# Altium project POETIC_Processor_V2.PrjPcb (part 2 of 2)

## Sheet AD_1.SchDoc
size A2; Date: Date; CompanyName: HESSO; Engineer: Name; Address1: Route du Rawyl 47; Address2: 1950 Sion; Address3: Switzerland; DocumentNumber: 6; SheetNumber: 6; SheetTotal: 8; ProjectName: Project Name
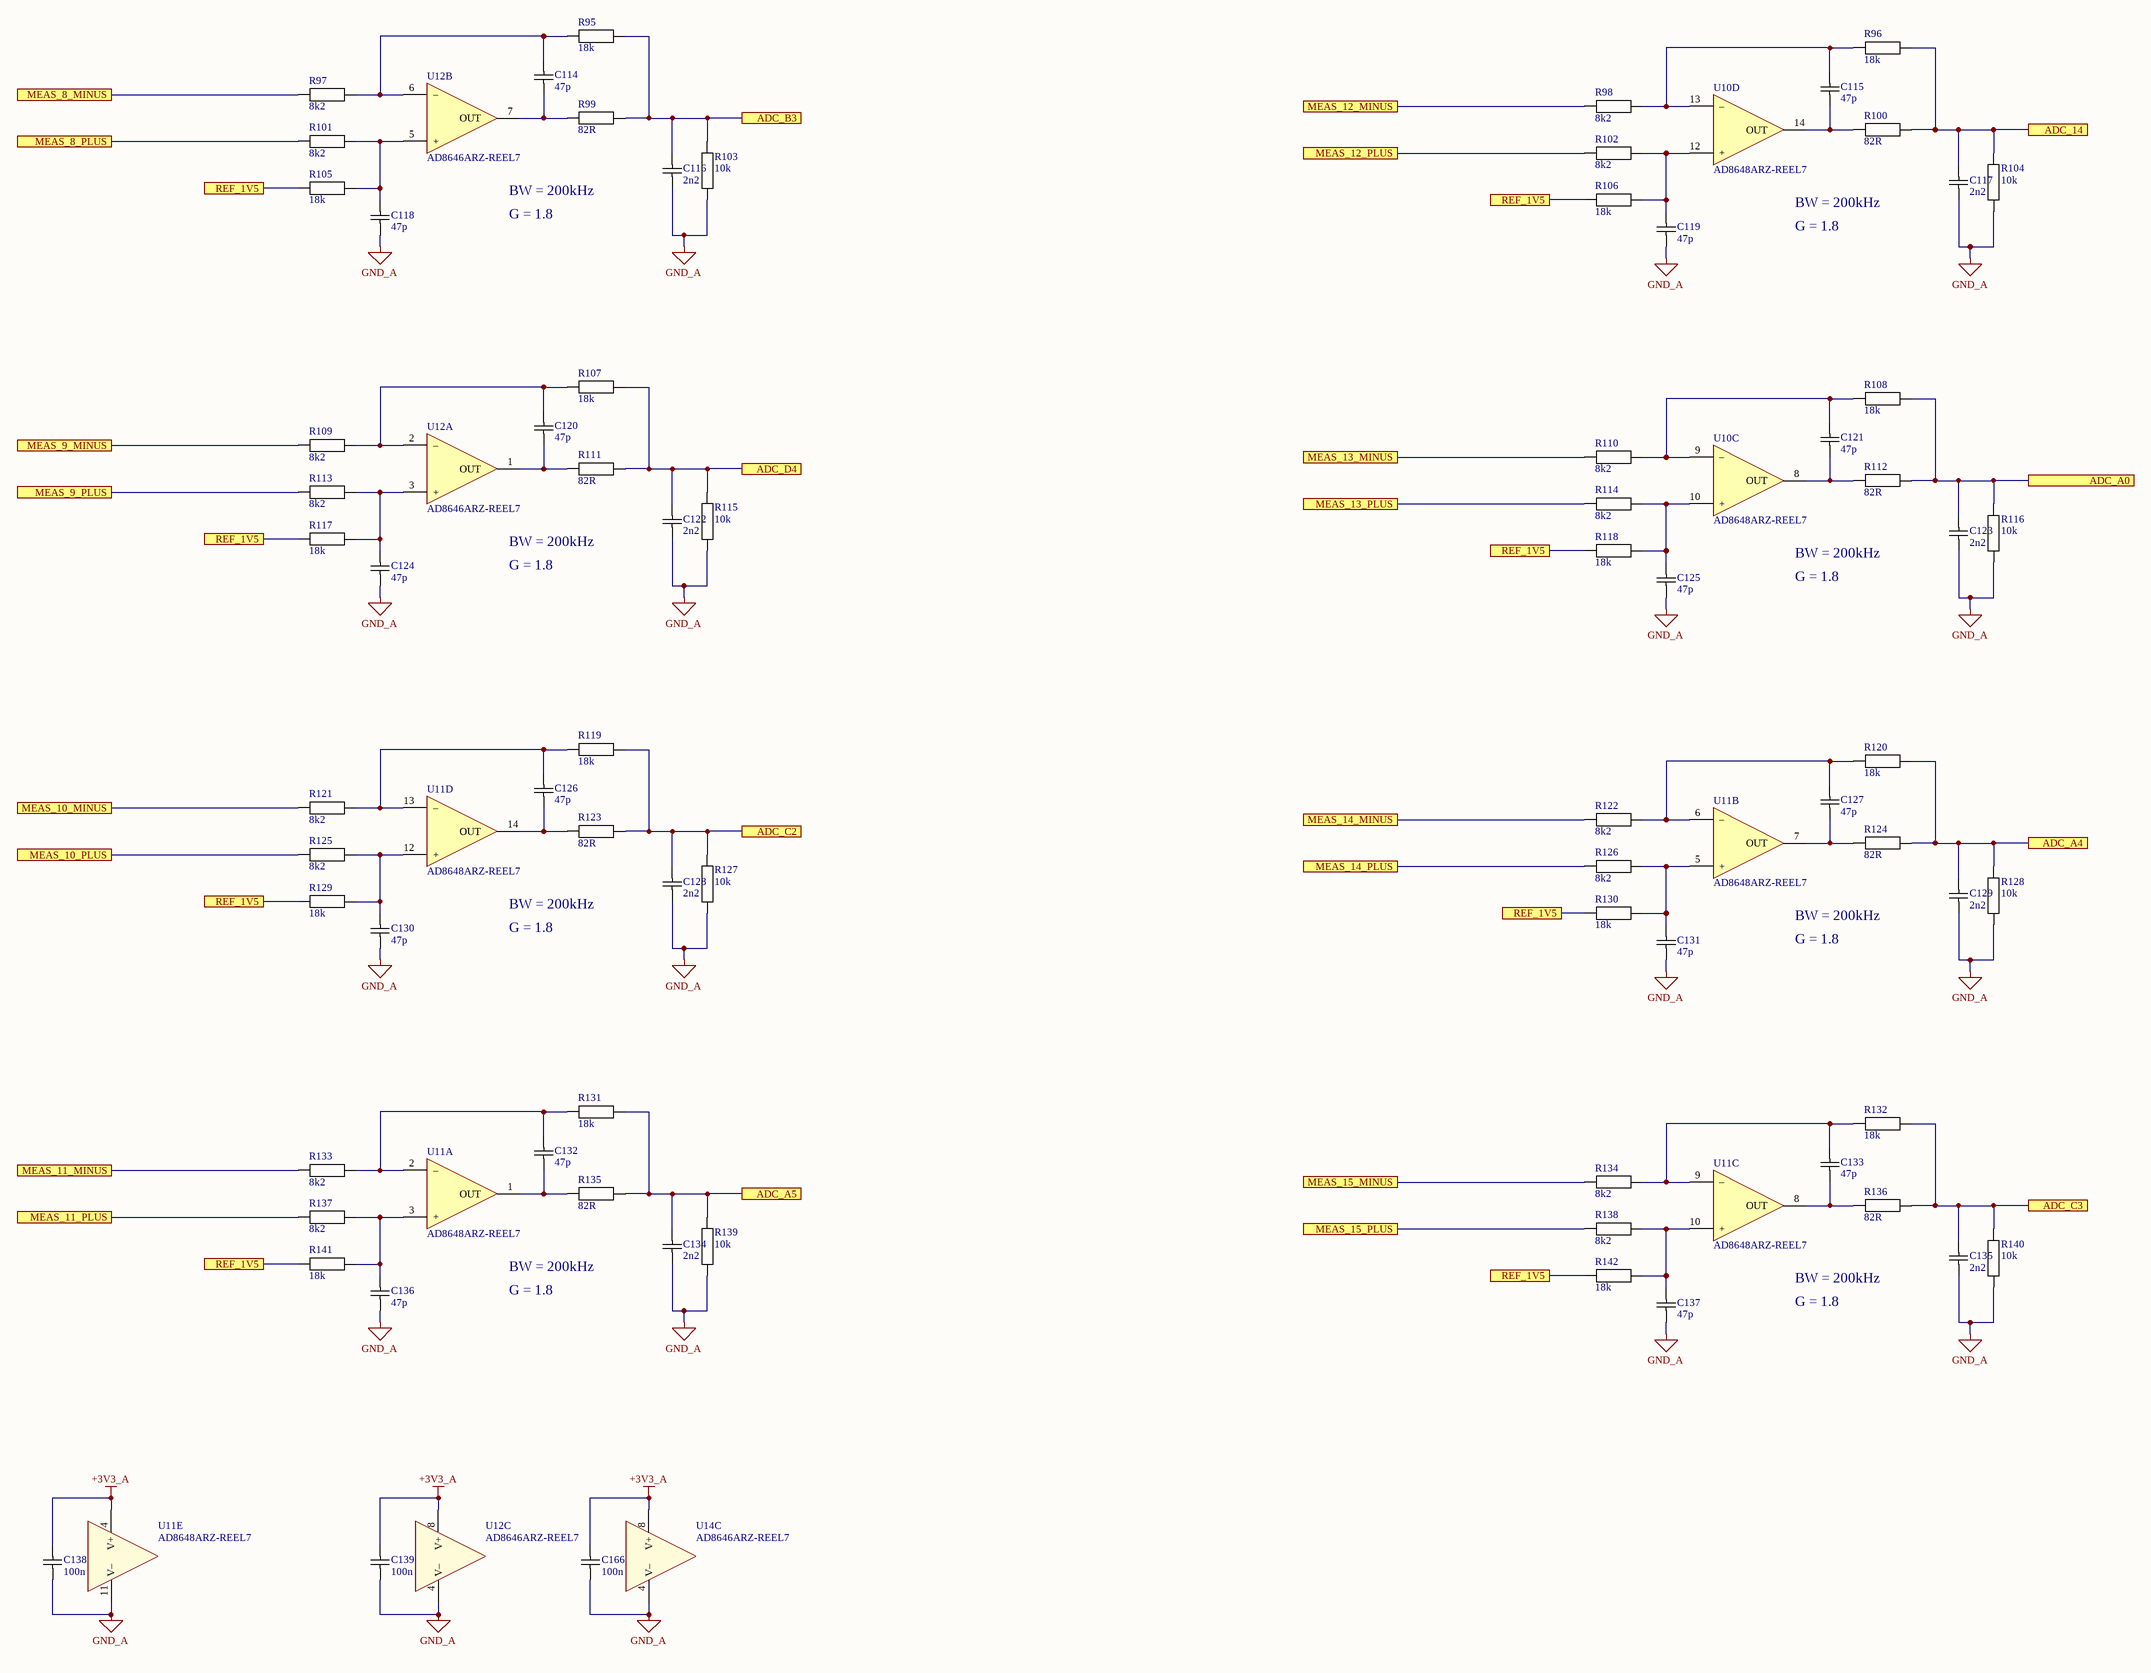
[diagram p9: AD_1.SchDoc]

### Parts
C114  47p  [CAPACITOR 1608 REFLOW]
C115  47p  [CAPACITOR 1608 REFLOW]
C116  2n2  [CAPACITOR 1608 REFLOW]
C117  2n2  [CAPACITOR 1608 REFLOW]
C118  47p  [CAPACITOR 1608 REFLOW]
C119  47p  [CAPACITOR 1608 REFLOW]
C120  47p  [CAPACITOR 1608 REFLOW]
C121  47p  [CAPACITOR 1608 REFLOW]
C122  2n2  [CAPACITOR 1608 REFLOW]
C123  2n2  [CAPACITOR 1608 REFLOW]
C124  47p  [CAPACITOR 1608 REFLOW]
C125  47p  [CAPACITOR 1608 REFLOW]
C126  47p  [CAPACITOR 1608 REFLOW]
C127  47p  [CAPACITOR 1608 REFLOW]
C128  2n2  [CAPACITOR 1608 REFLOW]
C129  2n2  [CAPACITOR 1608 REFLOW]
C130  47p  [CAPACITOR 1608 REFLOW]
C131  47p  [CAPACITOR 1608 REFLOW]
C132  47p  [CAPACITOR 1608 REFLOW]
C133  47p  [CAPACITOR 1608 REFLOW]
C134  2n2  [CAPACITOR 1608 REFLOW]
C135  2n2  [CAPACITOR 1608 REFLOW]
C136  47p  [CAPACITOR 1608 REFLOW]
C137  47p  [CAPACITOR 1608 REFLOW]
C138  100n  [CAPACITOR 1608 REFLOW]
C139  100n  [CAPACITOR 1608 REFLOW]
C166  100n  [CAPACITOR 1608 REFLOW]
R95  18k  [RESISTOR 1608 REFLOW]
R96  18k  [RESISTOR 1608 REFLOW]
R97  8k2  [RESISTOR 1608 REFLOW]
R98  8k2  [RESISTOR 1608 REFLOW]
R99  82R  [RESISTOR 1608 REFLOW]
R100  82R  [RESISTOR 1608 REFLOW]
R101  8k2  [RESISTOR 1608 REFLOW]
R102  8k2  [RESISTOR 1608 REFLOW]
R103  10k  [RESISTOR 1608 REFLOW]
R104  10k  [RESISTOR 1608 REFLOW]
R105  18k  [RESISTOR 1608 REFLOW]
R106  18k  [RESISTOR 1608 REFLOW]
R107  18k  [RESISTOR 1608 REFLOW]
R108  18k  [RESISTOR 1608 REFLOW]
R109  8k2  [RESISTOR 1608 REFLOW]
R110  8k2  [RESISTOR 1608 REFLOW]
R111  82R  [RESISTOR 1608 REFLOW]
R112  82R  [RESISTOR 1608 REFLOW]
R113  8k2  [RESISTOR 1608 REFLOW]
R114  8k2  [RESISTOR 1608 REFLOW]
R115  10k  [RESISTOR 1608 REFLOW]
R116  10k  [RESISTOR 1608 REFLOW]
R117  18k  [RESISTOR 1608 REFLOW]
R118  18k  [RESISTOR 1608 REFLOW]
R119  18k  [RESISTOR 1608 REFLOW]
R120  18k  [RESISTOR 1608 REFLOW]
R121  8k2  [RESISTOR 1608 REFLOW]
R122  8k2  [RESISTOR 1608 REFLOW]
R123  82R  [RESISTOR 1608 REFLOW]
R124  82R  [RESISTOR 1608 REFLOW]
R125  8k2  [RESISTOR 1608 REFLOW]
R126  8k2  [RESISTOR 1608 REFLOW]
R127  10k  [RESISTOR 1608 REFLOW]
R128  10k  [RESISTOR 1608 REFLOW]
R129  18k  [RESISTOR 1608 REFLOW]
R130  18k  [RESISTOR 1608 REFLOW]
R131  18k  [RESISTOR 1608 REFLOW]
R132  18k  [RESISTOR 1608 REFLOW]
R133  8k2  [RESISTOR 1608 REFLOW]
R134  8k2  [RESISTOR 1608 REFLOW]
R135  82R  [RESISTOR 1608 REFLOW]
R136  82R  [RESISTOR 1608 REFLOW]
R137  8k2  [RESISTOR 1608 REFLOW]
R138  8k2  [RESISTOR 1608 REFLOW]
R139  10k  [RESISTOR 1608 REFLOW]
R140  10k  [RESISTOR 1608 REFLOW]
R141  18k  [RESISTOR 1608 REFLOW]
R142  18k  [RESISTOR 1608 REFLOW]
U10  AD8648ARZ-REEL7  [SO14 P1.27 C4.0X8.8 H1.75]  (parts C,D of 5)
U11  AD8648ARZ-REEL7  [SO14 P1.27 C4.0X8.8 H1.75]  (parts A,B,C,D,E of 5)
U12  AD8646ARZ-REEL7  [SO8 P1.27 C4.0X5.0 H1.75]  (parts A,B,C of 3)
U14  AD8646ARZ-REEL7  [SO8 P1.27 C4.0X5.0 H1.75]  (part C of 3)

### Ports
ADC_14, ADC_A0, ADC_A4, ADC_A5, ADC_B3, ADC_C2, ADC_C3, ADC_D4, MEAS_8_MINUS, MEAS_8_PLUS, MEAS_9_MINUS, MEAS_9_PLUS, MEAS_10_MINUS, MEAS_10_PLUS, MEAS_11_MINUS, MEAS_11_PLUS, MEAS_12_MINUS, MEAS_12_PLUS, MEAS_13_MINUS, MEAS_13_PLUS, MEAS_14_MINUS, MEAS_14_PLUS, MEAS_15_MINUS, MEAS_15_PLUS, REF_1V5

### Nets
+3V3_A: C138.2 C139.2 C166.2 U11.4(V+) U12.8(V+) U14.8(V+)
GND_A: C116.1 C117.1 C118.1 C119.1 C122.1 C123.1 C124.1 C125.1 C128.1 C129.1 C130.1 C131.1 C134.1 C135.1 C136.1 C137.1 C138.1 C139.1 C166.1 R103.2 R104.2 R115.2 R116.2 R127.2 R128.2 R139.2 R140.2 U11.11(V–) U12.4(V–) U14.4(V–)
ADC_14: C117.2 R96.2 R100.2 R104.1 ; port ADC_14
ADC_A0: C123.2 R108.2 R112.2 R116.1 ; port ADC_A0
ADC_A4: C129.2 R120.2 R124.2 R128.1 ; port ADC_A4
ADC_A5: C134.2 R131.2 R135.2 R139.1 ; port ADC_A5
ADC_B3: C116.2 R95.2 R99.2 R103.1 ; port ADC_B3
ADC_C2: C128.2 R119.2 R123.2 R127.1 ; port ADC_C2
ADC_C3: C135.2 R132.2 R136.2 R140.1 ; port ADC_C3
ADC_D4: C122.2 R107.2 R111.2 R115.1 ; port ADC_D4
MEAS_8_MINUS: R97.1 ; port MEAS_8_MINUS
MEAS_8_PLUS: R101.1 ; port MEAS_8_PLUS
MEAS_9_MINUS: R109.1 ; port MEAS_9_MINUS
MEAS_9_PLUS: R113.1 ; port MEAS_9_PLUS
MEAS_10_MINUS: R121.1 ; port MEAS_10_MINUS
MEAS_10_PLUS: R125.1 ; port MEAS_10_PLUS
MEAS_11_MINUS: R133.1 ; port MEAS_11_MINUS
MEAS_11_PLUS: R137.1 ; port MEAS_11_PLUS
MEAS_12_MINUS: R98.1 ; port MEAS_12_MINUS
MEAS_12_PLUS: R102.1 ; port MEAS_12_PLUS
MEAS_13_MINUS: R110.1 ; port MEAS_13_MINUS
MEAS_13_PLUS: R114.1 ; port MEAS_13_PLUS
MEAS_14_MINUS: R122.1 ; port MEAS_14_MINUS
MEAS_14_PLUS: R126.1 ; port MEAS_14_PLUS
MEAS_15_MINUS: R134.1 ; port MEAS_15_MINUS
MEAS_15_PLUS: R138.1 ; port MEAS_15_PLUS
REF_1V5: R105.2 R106.2 R117.2 R118.2 R129.2 R130.2 R141.2 R142.2 ; port REF_1V5
NetC114_1: C114.1 R99.1 U12.7(OUT)
NetC114_2: C114.2 R95.1 R97.2 U12.6(–)
NetC115_1: C115.1 R100.1 U10.14(OUT)
NetC115_2: C115.2 R96.1 R98.2 U10.13(–)
NetC118_2: C118.2 R101.2 R105.1 U12.5(+)
NetC119_2: C119.2 R102.2 R106.1 U10.12(+)
NetC120_1: C120.1 R111.1 U12.1(OUT)
NetC120_2: C120.2 R107.1 R109.2 U12.2(–)
NetC121_1: C121.1 R112.1 U10.8(OUT)
NetC121_2: C121.2 R108.1 R110.2 U10.9(–)
NetC124_2: C124.2 R113.2 R117.1 U12.3(+)
NetC125_2: C125.2 R114.2 R118.1 U10.10(+)
NetC126_1: C126.1 R123.1 U11.14(OUT)
NetC126_2: C126.2 R119.1 R121.2 U11.13(–)
NetC127_1: C127.1 R124.1 U11.7(OUT)
NetC127_2: C127.2 R120.1 R122.2 U11.6(–)
NetC130_2: C130.2 R125.2 R129.1 U11.12(+)
NetC131_2: C131.2 R126.2 R130.1 U11.5(+)
NetC132_1: C132.1 R135.1 U11.1(OUT)
NetC132_2: C132.2 R131.1 R133.2 U11.2(–)
NetC133_1: C133.1 R136.1 U11.8(OUT)
NetC133_2: C133.2 R132.1 R134.2 U11.9(–)
NetC136_2: C136.2 R137.2 R141.1 U11.3(+)
NetC137_2: C137.2 R138.2 R142.1 U11.10(+)

### Notes on the sheet
- BW = 200kHz
- G = 1.8
- Date :
- Revision :
- Sheet
- of
- Design by :

### Library data of the parts
C114-C139 C166 = Capacitor: Capacitor X7R 10% 50V 1608(0603)
  C114 C115 C118-C121 C124-C127 C130-C133 C136 C137: Value: 47p
  C116 C117 C122 C123 C128 C129 C134 C135: Value: 2n2
  C138 C139 C166: Value: 100n
R95-R142 = Resistor: Resistor 1% 50V 100mW 1608(0603)
  R95 R96 R105-R108 R117-R120 R129-R132 R141 R142: Value: 18k
  R97 R98 R101 R102 R109 R110 R113 R114 R121 R122 R125 R126 R133 R134 R137 R138: Value: 8k2
  R99 R100 R111 R112 R123 R124 R135 R136: Value: 82R
  R103 R104 R115 R116 R127 R128 R139 R140: Value: 10k
U10 U11 = OPA QUAD: Generic quad OPA 14 pins; Manufacturer: Analog Devices; Value: AD8648ARZ-REEL7; Mouser No.: 584-AD8648ARZ-R7
U12 U14 = OPA DUAL: Generic dual OPA 8 pins; Manufacturer: Analog Devices; Value: AD8646ARZ-REEL7; Mouser No.: 584-AD8646ARZ-R7

## Sheet AD_2.SchDoc
size A2; Date: Date; CompanyName: HESSO; Engineer: Name; Address1: Route du Rawyl 47; Address2: 1950 Sion; Address3: Switzerland; DocumentNumber: 7; SheetNumber: 7; SheetTotal: 8; ProjectName: Project Name
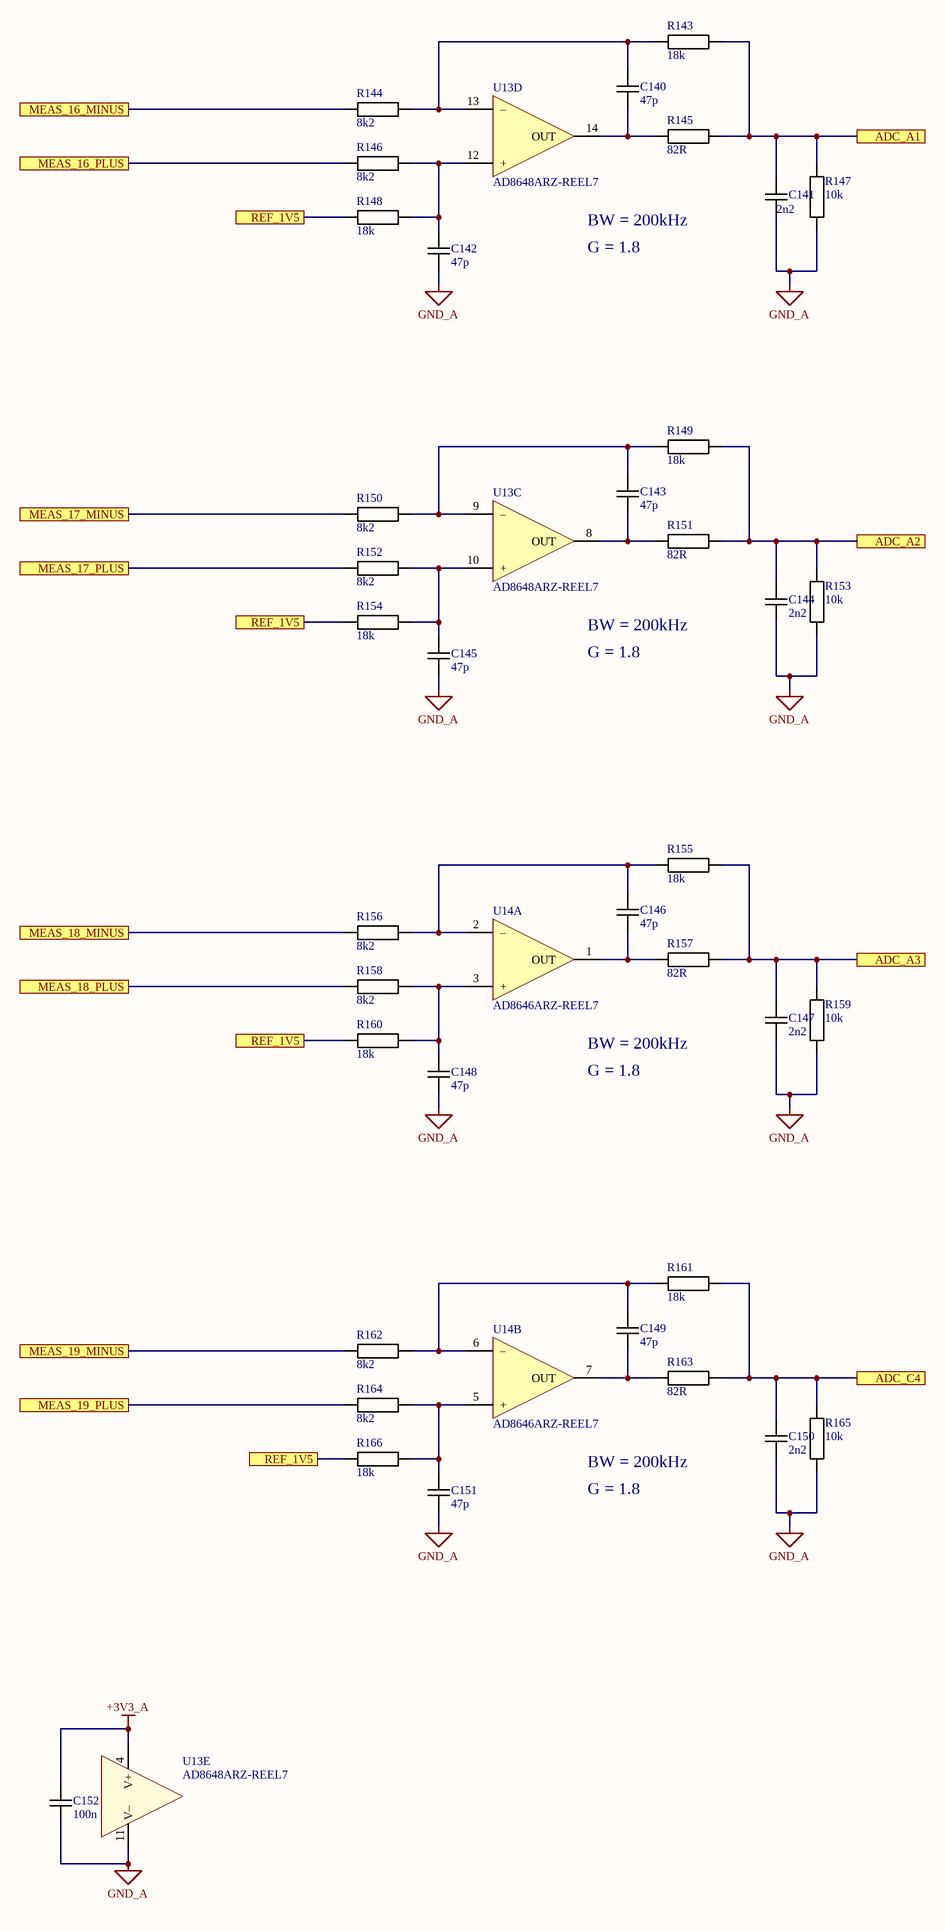
[diagram p10: AD_2.SchDoc]

### Parts
C140  47p  [CAPACITOR 1608 REFLOW]
C141  2n2  [CAPACITOR 1608 REFLOW]
C142  47p  [CAPACITOR 1608 REFLOW]
C143  47p  [CAPACITOR 1608 REFLOW]
C144  2n2  [CAPACITOR 1608 REFLOW]
C145  47p  [CAPACITOR 1608 REFLOW]
C146  47p  [CAPACITOR 1608 REFLOW]
C147  2n2  [CAPACITOR 1608 REFLOW]
C148  47p  [CAPACITOR 1608 REFLOW]
C149  47p  [CAPACITOR 1608 REFLOW]
C150  2n2  [CAPACITOR 1608 REFLOW]
C151  47p  [CAPACITOR 1608 REFLOW]
C152  100n  [CAPACITOR 1608 REFLOW]
R143  18k  [RESISTOR 1608 REFLOW]
R144  8k2  [RESISTOR 1608 REFLOW]
R145  82R  [RESISTOR 1608 REFLOW]
R146  8k2  [RESISTOR 1608 REFLOW]
R147  10k  [RESISTOR 1608 REFLOW]
R148  18k  [RESISTOR 1608 REFLOW]
R149  18k  [RESISTOR 1608 REFLOW]
R150  8k2  [RESISTOR 1608 REFLOW]
R151  82R  [RESISTOR 1608 REFLOW]
R152  8k2  [RESISTOR 1608 REFLOW]
R153  10k  [RESISTOR 1608 REFLOW]
R154  18k  [RESISTOR 1608 REFLOW]
R155  18k  [RESISTOR 1608 REFLOW]
R156  8k2  [RESISTOR 1608 REFLOW]
R157  82R  [RESISTOR 1608 REFLOW]
R158  8k2  [RESISTOR 1608 REFLOW]
R159  10k  [RESISTOR 1608 REFLOW]
R160  18k  [RESISTOR 1608 REFLOW]
R161  18k  [RESISTOR 1608 REFLOW]
R162  8k2  [RESISTOR 1608 REFLOW]
R163  82R  [RESISTOR 1608 REFLOW]
R164  8k2  [RESISTOR 1608 REFLOW]
R165  10k  [RESISTOR 1608 REFLOW]
R166  18k  [RESISTOR 1608 REFLOW]
U13  AD8648ARZ-REEL7  [SO14 P1.27 C4.0X8.8 H1.75]  (parts C,D,E of 5)
U14  AD8646ARZ-REEL7  [SO8 P1.27 C4.0X5.0 H1.75]  (parts A,B of 3)

### Ports
ADC_A1, ADC_A2, ADC_A3, ADC_C4, MEAS_16_MINUS, MEAS_16_PLUS, MEAS_17_MINUS, MEAS_17_PLUS, MEAS_18_MINUS, MEAS_18_PLUS, MEAS_19_MINUS, MEAS_19_PLUS, REF_1V5

### Nets
+3V3_A: C152.2 U13.4(V+)
GND_A: C141.1 C142.1 C144.1 C145.1 C147.1 C148.1 C150.1 C151.1 C152.1 R147.2 R153.2 R159.2 R165.2 U13.11(V–)
ADC_A1: C141.2 R143.2 R145.2 R147.1 ; port ADC_A1
ADC_A2: C144.2 R149.2 R151.2 R153.1 ; port ADC_A2
ADC_A3: C147.2 R155.2 R157.2 R159.1 ; port ADC_A3
ADC_C4: C150.2 R161.2 R163.2 R165.1 ; port ADC_C4
MEAS_16_MINUS: R144.1 ; port MEAS_16_MINUS
MEAS_16_PLUS: R146.1 ; port MEAS_16_PLUS
MEAS_17_MINUS: R150.1 ; port MEAS_17_MINUS
MEAS_17_PLUS: R152.1 ; port MEAS_17_PLUS
MEAS_18_MINUS: R156.1 ; port MEAS_18_MINUS
MEAS_18_PLUS: R158.1 ; port MEAS_18_PLUS
MEAS_19_MINUS: R162.1 ; port MEAS_19_MINUS
MEAS_19_PLUS: R164.1 ; port MEAS_19_PLUS
REF_1V5: R148.2 R154.2 R160.2 R166.2 ; port REF_1V5
NetC140_1: C140.1 R145.1 U13.14(OUT)
NetC140_2: C140.2 R143.1 R144.2 U13.13(–)
NetC142_2: C142.2 R146.2 R148.1 U13.12(+)
NetC143_1: C143.1 R151.1 U13.8(OUT)
NetC143_2: C143.2 R149.1 R150.2 U13.9(–)
NetC145_2: C145.2 R152.2 R154.1 U13.10(+)
NetC146_1: C146.1 R157.1 U14.1(OUT)
NetC146_2: C146.2 R155.1 R156.2 U14.2(–)
NetC148_2: C148.2 R158.2 R160.1 U14.3(+)
NetC149_1: C149.1 R163.1 U14.7(OUT)
NetC149_2: C149.2 R161.1 R162.2 U14.6(–)
NetC151_2: C151.2 R164.2 R166.1 U14.5(+)

### Notes on the sheet
- BW = 200kHz
- G = 1.8
- Date :
- Revision :
- Sheet
- of
- Design by :

### Library data of the parts
C140-C152 = Capacitor: Capacitor X7R 10% 50V 1608(0603)
  C140 C142 C143 C145 C146 C148 C149 C151: Value: 47p
  C141 C144 C147 C150: Value: 2n2
  C152: Value: 100n
R143-R166 = Resistor: Resistor 1% 50V 100mW 1608(0603)
  R143 R148 R149 R154 R155 R160 R161 R166: Value: 18k
  R144 R146 R150 R152 R156 R158 R162 R164: Value: 8k2
  R145 R151 R157 R163: Value: 82R
  R147 R153 R159 R165: Value: 10k
U13 = OPA QUAD: Generic quad OPA 14 pins; Manufacturer: Analog Device; Value: AD8648ARZ-REEL7; Mouser No.: 584-AD8648ARZ-R7
U14 = OPA DUAL: as U12 on sheet AD_1; Value: AD8646ARZ-REEL7; Mouser No.: 584-AD8646ARZ-R7

## Sheet Mezz_Board.SchDoc
size A2; Date: Date; CompanyName: HESSO; Engineer: Name; Address1: Route du Rawyl 47; Address2: 1950 Sion; Address3: Switzerland; DocumentNumber: 8; SheetNumber: 8; SheetTotal: 8; ProjectName: Project Name
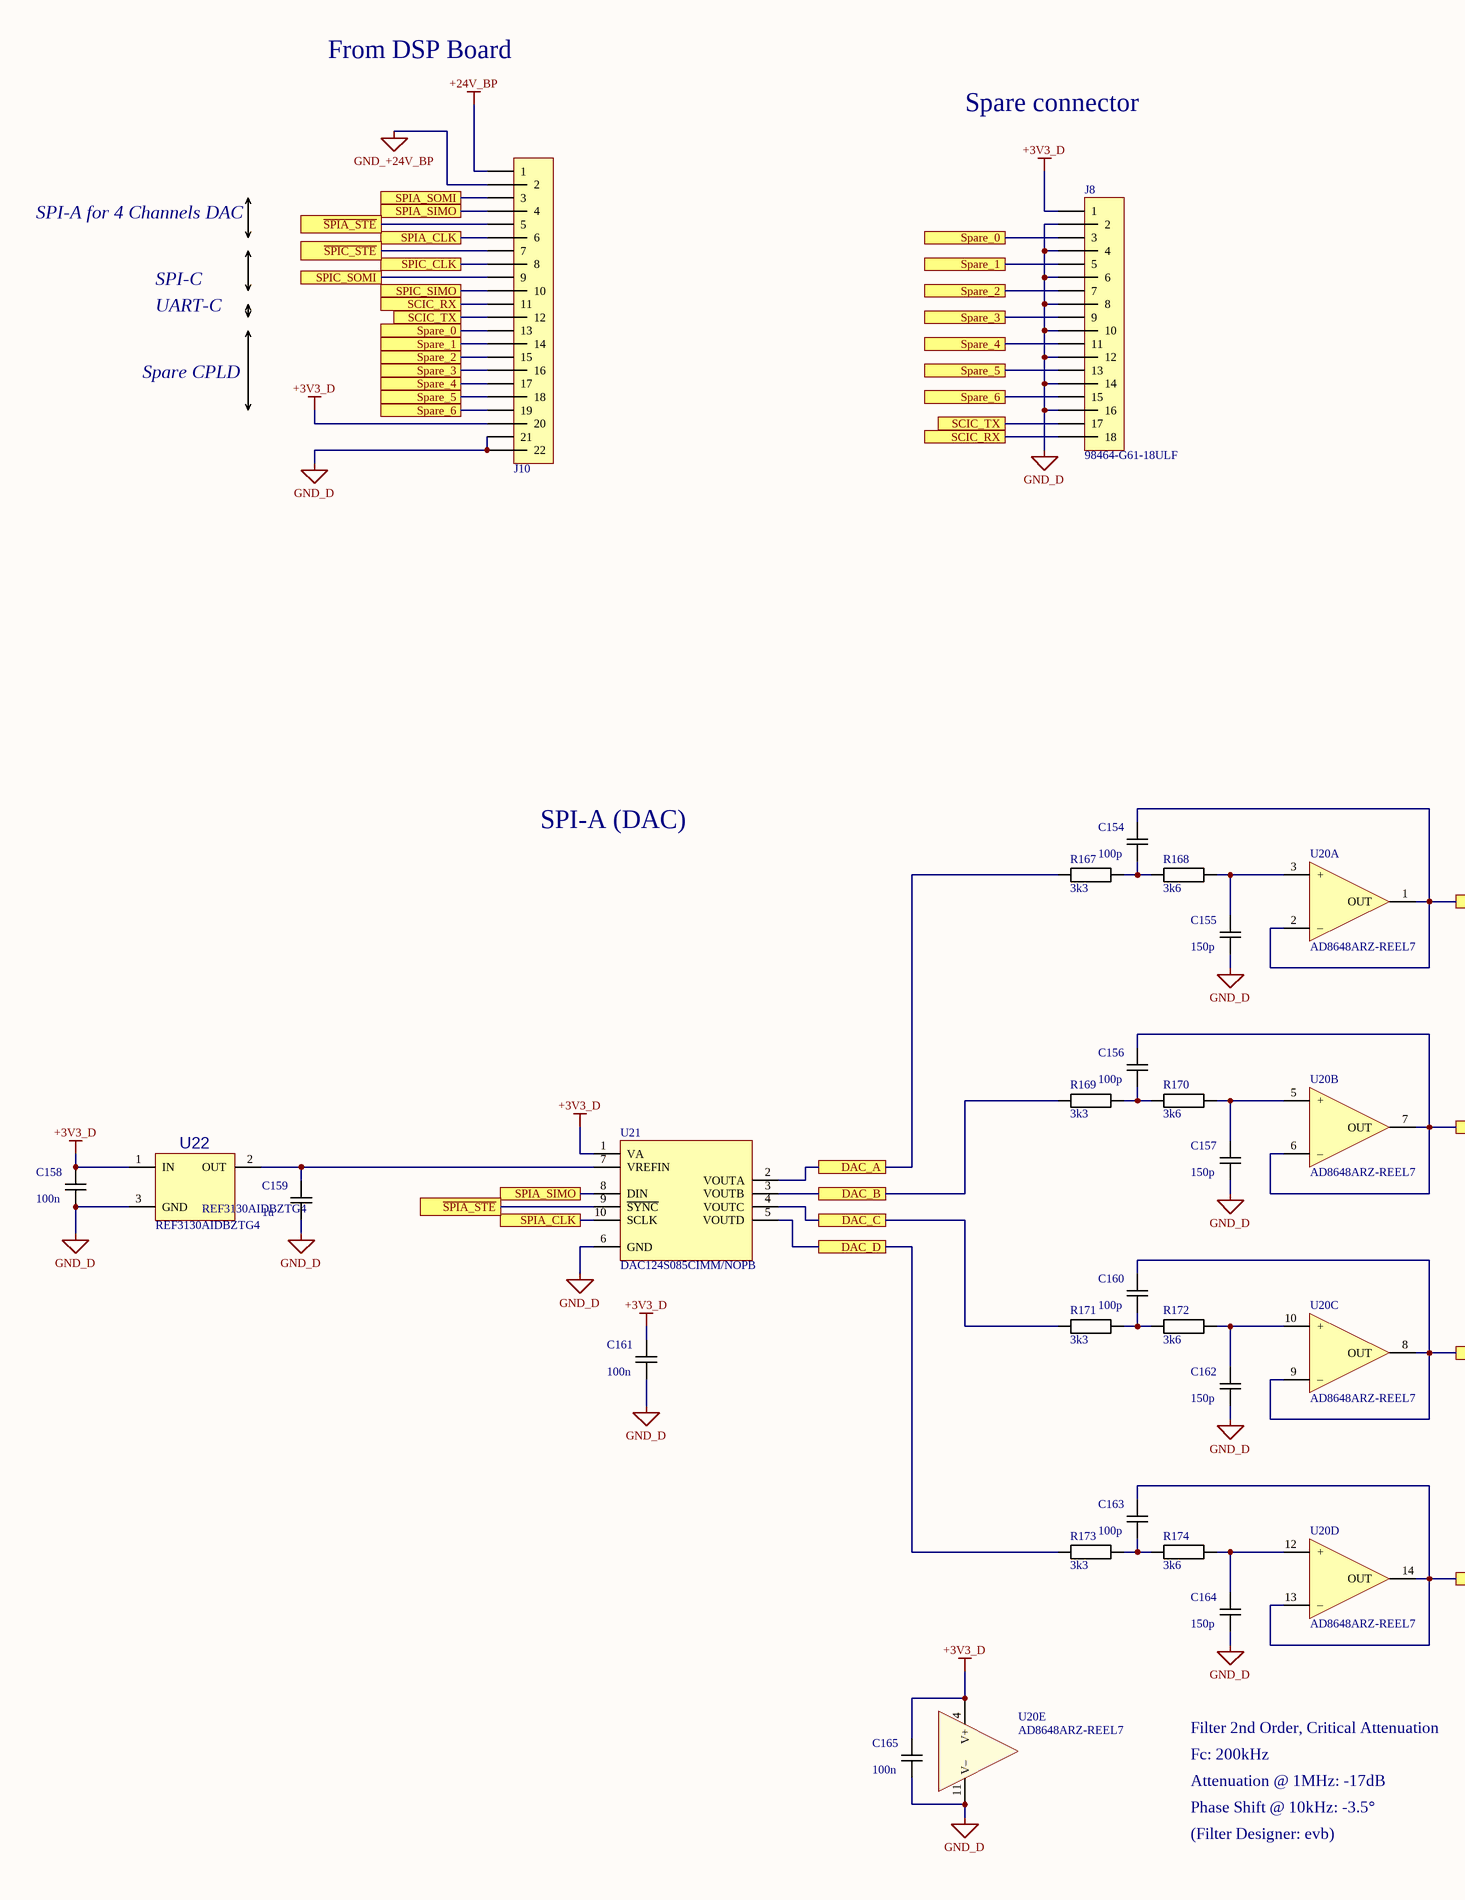
[diagram p11: Mezz_Board.SchDoc, left]
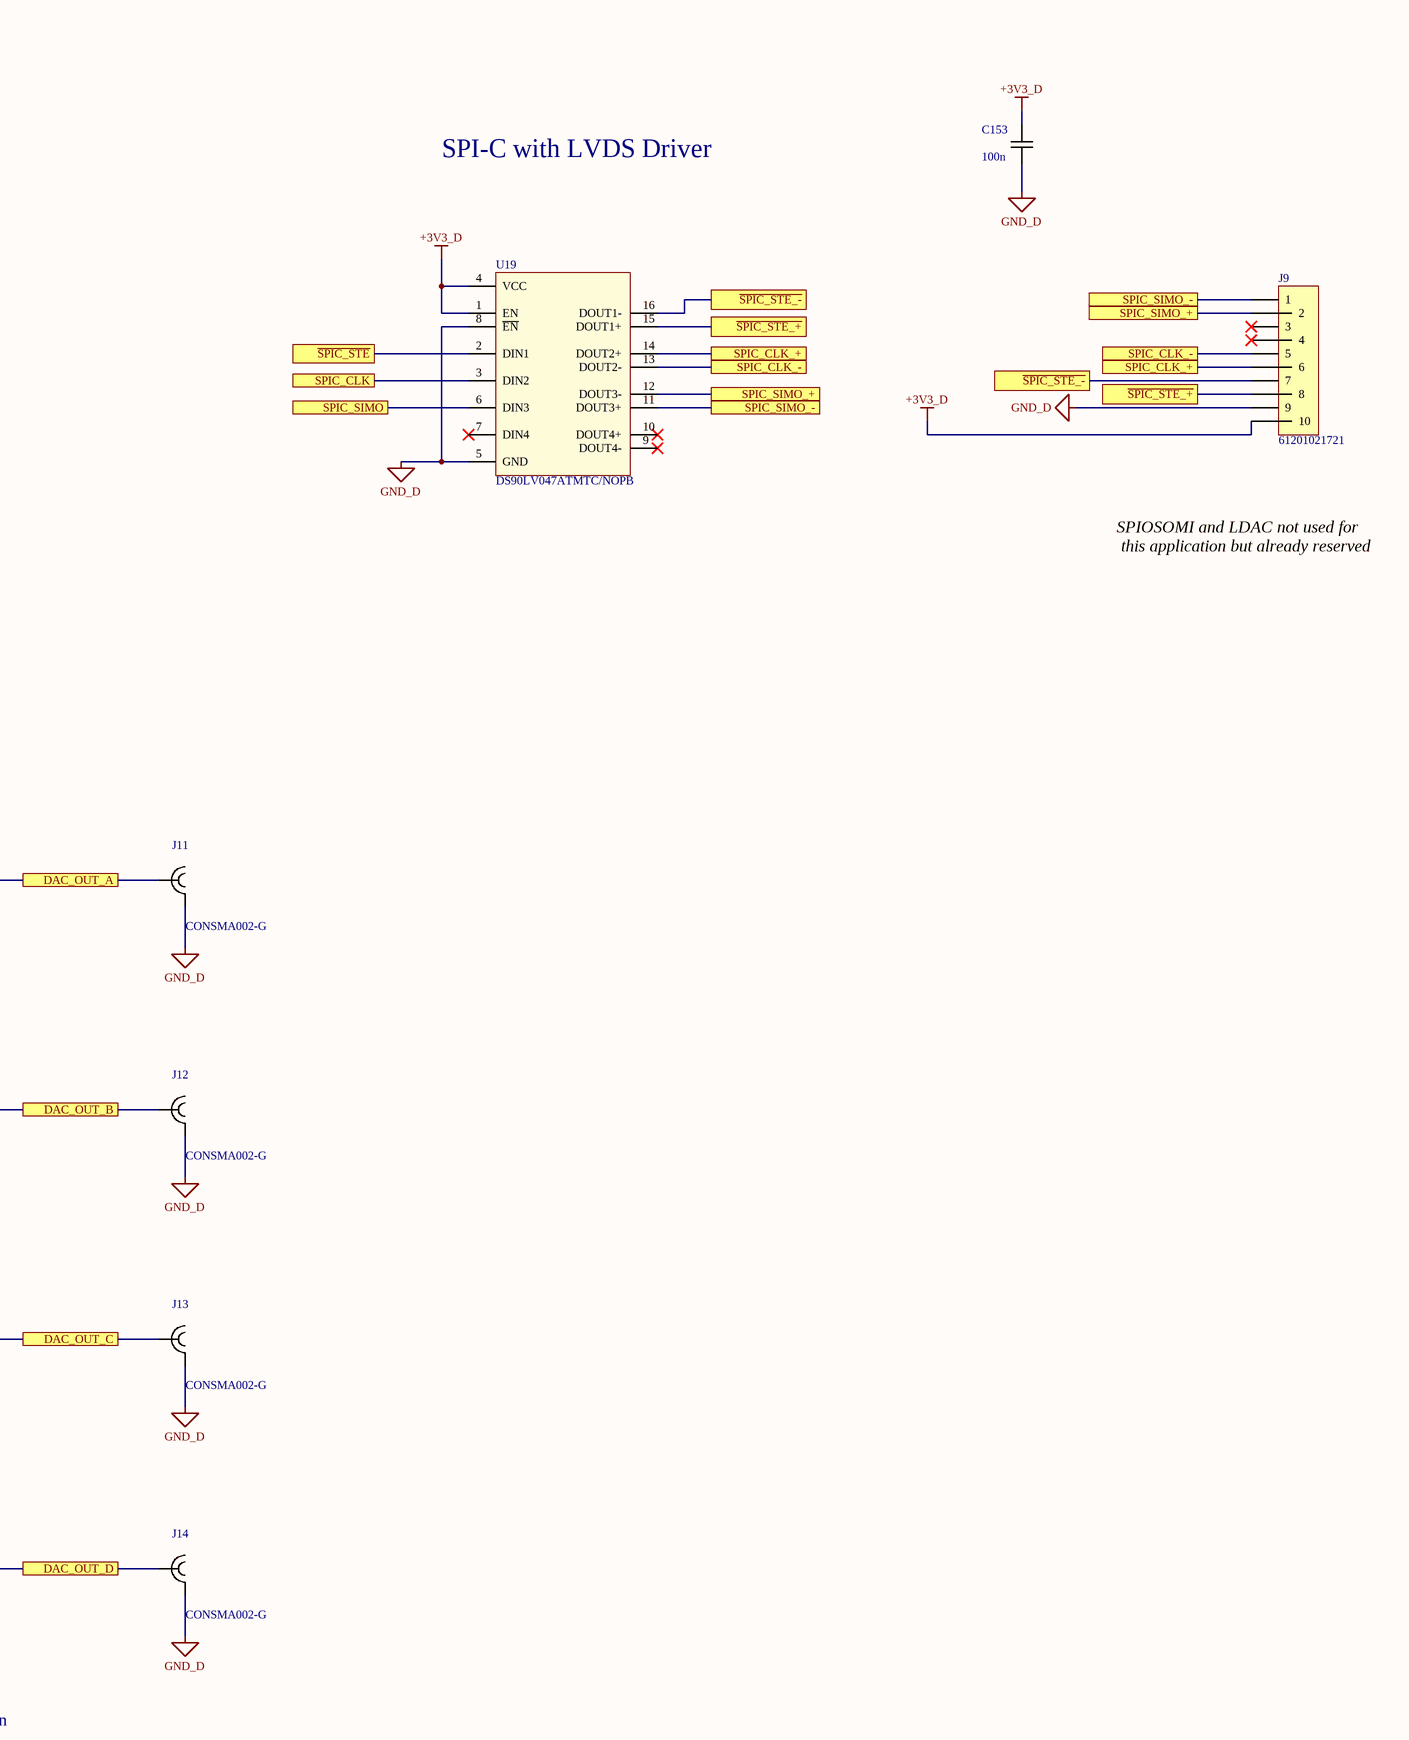
[diagram p12: Mezz_Board.SchDoc, right]

### Parts
C153  100n  [CAPACITOR 2012 REFLOW]
C154  100p  [CAPACITOR 2012 REFLOW]
C155  150p  [CAPACITOR 2012 REFLOW]
C156  100p  [CAPACITOR 2012 REFLOW]
C157  150p  [CAPACITOR 2012 REFLOW]
C158  100n  [CAPACITOR 2012 REFLOW]
C159  1u  [CAPACITOR 2012 REFLOW]
C160  100p  [CAPACITOR 2012 REFLOW]
C161  100n  [CAPACITOR 1608 REFLOW]
C162  150p  [CAPACITOR 2012 REFLOW]
C163  100p  [CAPACITOR 2012 REFLOW]
C164  150p  [CAPACITOR 2012 REFLOW]
C165  100n  [CAPACITOR 1608 REFLOW]
J8  98464-G61-18ULF  [FlatCable2x9 2MM Right Angle TH FCI 98614-G61-18ULF]
J9  61201021721  [FlatCable2x5 2.54MM RIGHT ANGLE TH]
J10  *  [PinHeader2x11 P2.54 A]  (value not drawn)
J11  CONSMA002-G  [SMA TH Right Angle Linx CONSMA002]
J12  CONSMA002-G  [SMA TH Right Angle Linx CONSMA002]
J13  CONSMA002-G  [SMA TH Right Angle Linx CONSMA002]
J14  CONSMA002-G  [SMA TH Right Angle Linx CONSMA002]
R167  3k3  [RESISTOR 2012 REFLOW]
R168  3k6  [RESISTOR 2012 REFLOW]
R169  3k3  [RESISTOR 2012 REFLOW]
R170  3k6  [RESISTOR 2012 REFLOW]
R171  3k3  [RESISTOR 2012 REFLOW]
R172  3k6  [RESISTOR 2012 REFLOW]
R173  3k3  [RESISTOR 2012 REFLOW]
R174  3k6  [RESISTOR 2012 REFLOW]
U19  DS90LV047ATMTC/NOPB  [TSSOP16 P0.65 C5.0x4.5 H1.1]
U20  AD8648ARZ-REEL7  [SO14 P1.27 C4.0X8.8 H1.75]  (parts A,B,C,D,E of 5)
U21  DAC124S085CIMM/NOPB  [VSSOP10 P0.5 C3.1X3.1 H1.1]
U22  REF3130AIDBZTG4  [SOT23 P0.95 C1.6x3.0 H1.3]

### Ports
DAC_A, DAC_B, DAC_C, DAC_D, DAC_OUT_A, DAC_OUT_B, DAC_OUT_C, DAC_OUT_D, SCIC_RX, SCIC_TX, Spare_0, Spare_1, Spare_2, Spare_3, Spare_4, Spare_5, Spare_6, SPIA_CLK, SPIA_SIMO, SPIA_SOMI, SPIC_CLK, SPIC_CLK_+, SPIC_CLK_-, SPIC_SIMO, SPIC_SIMO_+, SPIC_SIMO_-, SPIC_SOMI, ~{SPIA_STE}, ~{SPIC_STE_+}, ~{SPIC_STE_-}, ~{SPIC_STE}

### Nets
+3V3_D: C153.2 C158.2 C161.2 C165.2 J8.1 J9.10 J10.20 U19.1(EN) U19.4(VCC) U20.4(V+) U21.1(VA) U22.1(IN)
+24V_BP: J10.1
GND_+24V_BP: J10.2
GND_D: C153.1 C155.1 C157.1 C158.1 C159.1 C161.1 C162.1 C164.1 C165.1 J8.2 J8.4 J8.6 J8.8 J8.10 J8.12 J8.14 J8.16 J9.9 J10.21 J10.22 J11.2 J12.2 J13.2 J14.2 U19.5(GND) U19.8(~{EN}) U20.11(V–) U21.6(GND) U22.3(GND)
~{SPIA_STE}: J10.5 U21.9(~{SYNC}) ; port ~{SPIA_STE}
~{SPIC_STE}: J10.7 U19.2(DIN1) ; port ~{SPIC_STE}
~{SPIC_STE_+}: J9.8 U19.15(DOUT1+) ; port ~{SPIC_STE_+}
~{SPIC_STE_-}: J9.7 U19.16(DOUT1-) ; port ~{SPIC_STE_-}
DAC_A: R167.1 U21.2(VOUTA) ; port DAC_A
DAC_B: R169.1 U21.3(VOUTB) ; port DAC_B
DAC_C: R171.1 U21.4(VOUTC) ; port DAC_C
DAC_D: R173.1 U21.5(VOUTD) ; port DAC_D
DAC_OUT_A: C154.2 J11.1 U20.1(OUT) U20.2(–) ; port DAC_OUT_A
DAC_OUT_B: C156.2 J12.1 U20.6(–) U20.7(OUT) ; port DAC_OUT_B
DAC_OUT_C: C160.2 J13.1 U20.8(OUT) U20.9(–) ; port DAC_OUT_C
DAC_OUT_D: C163.2 J14.1 U20.13(–) U20.14(OUT) ; port DAC_OUT_D
SCIC_RX: J8.18 J10.11 ; port SCIC_RX
SCIC_TX: J8.17 J10.12 ; port SCIC_TX
Spare_0: J8.3 J10.13 ; port Spare_0
Spare_1: J8.5 J10.14 ; port Spare_1
Spare_2: J8.7 J10.15 ; port Spare_2
Spare_3: J8.9 J10.16 ; port Spare_3
Spare_4: J8.11 J10.17 ; port Spare_4
Spare_5: J8.13 J10.18 ; port Spare_5
Spare_6: J8.15 J10.19 ; port Spare_6
SPIA_CLK: J10.6 U21.10(SCLK) ; port SPIA_CLK
SPIA_SIMO: J10.4 U21.8(DIN) ; port SPIA_SIMO
SPIA_SOMI: J10.3 ; port SPIA_SOMI
SPIC_CLK: J10.8 U19.3(DIN2) ; port SPIC_CLK
SPIC_CLK_+: J9.6 U19.14(DOUT2+) ; port SPIC_CLK_+
SPIC_CLK_-: J9.5 U19.13(DOUT2-) ; port SPIC_CLK_-
SPIC_SIMO: J10.10 U19.6(DIN3) ; port SPIC_SIMO
SPIC_SIMO_+: J9.2 U19.12(DOUT3-) ; port SPIC_SIMO_+
SPIC_SIMO_-: J9.1 U19.11(DOUT3+) ; port SPIC_SIMO_-
SPIC_SOMI: J10.9 ; port SPIC_SOMI
NetC154_1: C154.1 R167.2 R168.1
NetC155_2: C155.2 R168.2 U20.3(+)
NetC156_1: C156.1 R169.2 R170.1
NetC157_2: C157.2 R170.2 U20.5(+)
NetC159_2: C159.2 U21.7(VREFIN) U22.2(OUT)
NetC160_1: C160.1 R171.2 R172.1
NetC162_2: C162.2 R172.2 U20.10(+)
NetC163_1: C163.1 R173.2 R174.1
NetC164_2: C164.2 R174.2 U20.12(+)

Not connected (* = marked no-connect by the designer): J9 3* 4*; U19 7(DIN4)* 9(DOUT4-)* 10(DOUT4+)*

### Notes on the sheet
- From DSP Board
- Spare connector
- SPI-A for 4 Channels DAC
- SPI-C with LVDS Driver
- SPI-C
- UART-C
- Spare CPLD
- SPIOSOMI and LDAC not used for
  this application but already reserved
- SPI-A (DAC)
- Filter 2nd Order, Critical Attenuation
- Fc: 200kHz
- Attenuation @ 1MHz: -17dB
- Phase Shift @ 10kHz: -3.5°
- (Filter Designer: evb)
- Date :
- Revision :
- Sheet
- of
- Design by :

### Library data of the parts
C153-C158 C160 C162-C164 = Capacitor: Capacitor X7R 10% 50V 2012(0805)
  C153 C158: Value: 100n
  C154 C156 C160 C163: Value: 100p
  C155 C157 C162 C164: Value: 150p
C159 = Capacitor: Capacitor X7R 10% 10V 2012(0805); Value: 1u
C161 C165 = Capacitor: Capacitor X7R 10% 50V 1608(0603); Value: 100n
J8 = FlatCable2x9: Manufacturer: Amphenol FCI; Mouser No.: 649-98464-G61-18ULF; Value: 98464-G61-18ULF
J9 = FlatCable2x5: Manufacturer: Wurth Elektronik; Mouser No.: 710-61201021721; Value: 61201021721
J10 = PinHeader2x11: Plug connector; Value: *
J11-J14 = SMA TH RIGHT ANGLE LINX CONSMA002: Manufacturer: Linx Technologies; Value: CONSMA002-G; Mouser No.: 712-CONSMA002-G
R167-R174 = Resistor: Resistor 1% 50V 125mW 2012(0805)
  R167 R169 R171 R173: Value: 3k3
  R168 R170 R172 R174: Value: 3k6
U19 = DS90LV047A: DS90LV047A 3-V LVDS Quad CMOS Differential Line Driver; Manufacturer: Texas Instruments; Value: DS90LV047ATMTC/NOPB; Mouser No.: 926-DS90LV047ATMTCNO
U20 = OPA QUAD: as U10 on sheet AD_1; Value: AD8648ARZ-REEL7; Mouser No.: 584-AD8648ARZ-R7
U21 = DAC124S085CIMM: DAC124S085 12-Bit Micro Power Quad Digital-to-Analog Converter With Rail-to-Rail Output; Manufacturer: Texas Instruments; Value: DAC124S085CIMM/NOPB; Mouser No.: 926-DAC124S085CIMMNO
U22 = REFERENCE SOT23 IN-OUT- GND: Generic Positive Voltage Reference; Manufacturer: Texas Instruments; Value: REF3130AIDBZTG4; Mouser No.: 595-REF3130AIDBZTG4

## Nets that join several sheets
+1V2: Processor (20 pins), Supply (C58.2 L2.2 TP6.1)
+1V8_D: Supply (C60.1 TP7.1 U5.7 U5.8), CPLD (6 pins)
+3V3_A: Processor (C19.2 C37.2 U1.36 U1.54), Supply (7 pins), AD_0 (C112.2 C113.2 U9.4 U10.4), AD_1 (6 pins), AD_2 (C152.2 U13.4)
+3V3_D: Processor (52 pins), Supply (11 pins), CPLD (36 pins), Connector_0 (9 pins), Mezz_Board (12 pins)
+3V3_F: Processor (C13.2 U1.72), Supply (C47.1 C48.1 NT3.2)
+24V_BP: Connector_0 (J4.1 J5.C32), Mezz_Board (J10.1)
GND_+24V_BP: Connector_0 (J4.2 J5.B32), Mezz_Board (J10.2)
GND_A: Processor (9 pins), Supply (16 pins), AD_0 (28 pins), AD_1 (30 pins), AD_2 (14 pins)
GND_D: Processor (43 pins), Supply (18 pins), CPLD (44 pins), Connector_0 (31 pins), Mezz_Board (29 pins)
~{SPIA_STE}: Processor (U1.102), Connector_0 (J4.5), Mezz_Board (J10.5 U21.9)
~{SPIC_STE}: Processor (U1.97), Connector_0 (J4.7), Mezz_Board (J10.7 U19.2)
ADC_14: Processor (U1.44), AD_1 (C117.2 R96.2 R100.2 R104.1)
ADC_15: Processor (U1.45), AD_0 (C102.2 R71.2 R75.2 R79.1)
ADC_A0: Processor (U1.43), AD_1 (C123.2 R108.2 R112.2 R116.1)
ADC_A1: Processor (U1.42), AD_2 (C141.2 R143.2 R145.2 R147.1)
ADC_A2: Processor (U1.41), AD_2 (C144.2 R149.2 R151.2 R153.1)
ADC_A3: Processor (U1.40), AD_2 (C147.2 R155.2 R157.2 R159.1)
ADC_A4: Processor (U1.39), AD_1 (C129.2 R120.2 R124.2 R128.1)
ADC_A5: Processor (U1.38), AD_1 (C134.2 R131.2 R135.2 R139.1)
ADC_B0: Processor (U1.46), AD_0 (C108.2 R83.2 R87.2 R91.1)
ADC_B1: Processor (U1.47), AD_0 (C103.2 R72.2 R76.2 R80.1)
ADC_B2: Processor (U1.48), AD_0 (C109.2 R84.2 R88.2 R92.1)
ADC_B3: Processor (U1.49), AD_1 (C116.2 R95.2 R99.2 R103.1)
ADC_C2: Processor (U1.31), AD_1 (C128.2 R119.2 R123.2 R127.1)
ADC_C3: Processor (U1.30), AD_1 (C135.2 R132.2 R136.2 R140.1)
ADC_C4: Processor (U1.29), AD_2 (C150.2 R161.2 R163.2 R165.1)
ADC_D0: Processor (U1.56), AD_0 (C91.2 R48.2 R52.2 R56.1)
ADC_D1: Processor (U1.57), AD_0 (C96.2 R59.2 R63.2 R67.1)
ADC_D2: Processor (U1.58), AD_0 (C90.2 R47.2 R51.2 R55.1)
ADC_D3: Processor (U1.59), AD_0 (C97.2 R60.2 R64.2 R68.1)
ADC_D4: Processor (U1.60), AD_1 (C122.2 R107.2 R111.2 R115.1)
BN_EN: CPLD (U8.109), Connector_0 (J5.A29)
BN_ERROR_R: CPLD (U8.107), Connector_0 (J5.C29 R15.1)
BN_ERROR_W: CPLD (U8.108), Connector_0 (J5.B29 R11.1)
BN_MASTER_RST: CPLD (U8.110), Connector_0 (J5.C27)
BP_GPIO_0: CPLD (U8.151), Connector_0 (J5.A14)
BP_GPIO_1: CPLD (U8.148), Connector_0 (J5.A15)
BP_GPIO_2: CPLD (U8.145), Connector_0 (J5.A16)
BP_GPIO_3: CPLD (U8.142), Connector_0 (J5.A17)
BP_GPIO_4: CPLD (U8.138), Connector_0 (J5.A19)
BP_GPIO_5: CPLD (U8.135), Connector_0 (J5.A20)
BP_GPIO_6: CPLD (U8.128), Connector_0 (J5.A21)
BP_GPIO_7: CPLD (U8.125), Connector_0 (J5.A22)
BP_GPIO_8: CPLD (U8.121), Connector_0 (J5.A24)
BP_GPIO_9: CPLD (U8.118), Connector_0 (J5.A25)
BP_GPIO_10: CPLD (U8.115), Connector_0 (J5.A26)
BP_GPIO_11: CPLD (U8.112), Connector_0 (J5.A27)
BP_GPIO_13: CPLD (U8.150), Connector_0 (J5.B14)
BP_GPIO_14: CPLD (U8.147), Connector_0 (J5.B15)
BP_GPIO_15: CPLD (U8.144), Connector_0 (J5.B16)
BP_GPIO_16: CPLD (U8.140), Connector_0 (J5.B17)
BP_GPIO_17: CPLD (U8.137), Connector_0 (J5.B19)
BP_GPIO_18: CPLD (U8.134), Connector_0 (J5.B20)
BP_GPIO_19: CPLD (U8.127), Connector_0 (J5.B21)
BP_GPIO_20: CPLD (U8.123), Connector_0 (J5.B22)
BP_GPIO_21: CPLD (U8.120), Connector_0 (J5.B24)
BP_GPIO_22: CPLD (U8.117), Connector_0 (J5.B25)
BP_GPIO_23: CPLD (U8.114), Connector_0 (J5.B26)
BP_GPIO_24: CPLD (U8.111), Connector_0 (J5.B27)
BP_GPIO_26: CPLD (U8.149), Connector_0 (J5.C14)
BP_GPIO_27: CPLD (U8.146), Connector_0 (J5.C15)
BP_GPIO_28: CPLD (U8.143), Connector_0 (J5.C16)
BP_GPIO_29: CPLD (U8.139), Connector_0 (J5.C17)
BP_GPIO_30: CPLD (U8.136), Connector_0 (J5.C19)
BP_GPIO_31: CPLD (U8.131), Connector_0 (J5.C20)
BP_GPIO_32: CPLD (U8.126), Connector_0 (J5.C21)
BP_GPIO_33: CPLD (U8.122), Connector_0 (J5.C22)
BP_GPIO_34: CPLD (U8.119), Connector_0 (J5.C24)
BP_GPIO_35: CPLD (U8.116), Connector_0 (J5.C25)
BP_GPIO_36: CPLD (U8.113), Connector_0 (J5.C26)
BP_PWM1A: CPLD (U8.180), Connector_0 (J5.A2)
BP_PWM1B: CPLD (U8.175), Connector_0 (J5.A3)
BP_PWM2A: CPLD (U8.171), Connector_0 (J5.A5)
BP_PWM2B: CPLD (U8.168), Connector_0 (J5.A6)
BP_PWM3A: CPLD (U8.165), Connector_0 (J5.A8)
BP_PWM3B: CPLD (U8.162), Connector_0 (J5.A9)
BP_PWM4A: CPLD (U8.159), Connector_0 (J5.A11)
BP_PWM4B: CPLD (U8.154), Connector_0 (J5.A12)
BP_PWM5A: CPLD (U8.179), Connector_0 (J5.B2)
BP_PWM5B: CPLD (U8.174), Connector_0 (J5.B3)
BP_PWM6A: CPLD (U8.170), Connector_0 (J5.B5)
BP_PWM6B: CPLD (U8.167), Connector_0 (J5.B6)
BP_PWM7A: CPLD (U8.164), Connector_0 (J5.B8)
BP_PWM7B: CPLD (U8.161), Connector_0 (J5.B9)
BP_PWM8A: CPLD (U8.158), Connector_0 (J5.B11)
BP_PWM8B: CPLD (U8.153), Connector_0 (J5.B12)
BP_PWM9A: CPLD (U8.178), Connector_0 (J5.C2)
BP_PWM9B: CPLD (U8.173), Connector_0 (J5.C3)
BP_PWM10A: CPLD (U8.169), Connector_0 (J5.C5)
BP_PWM10B: CPLD (U8.166), Connector_0 (J5.C6)
BP_PWM11A: CPLD (U8.163), Connector_0 (J5.C8)
BP_PWM11B: CPLD (U8.160), Connector_0 (J5.C9)
BP_PWM12A: CPLD (U8.155), Connector_0 (J5.C11)
BP_PWM12B_BN_PWM: CPLD (U8.152), Connector_0 (J5.C12)
DSP_CLK_OUT: Processor (U1.140), CPLD (U8.44)
DSP_PWM1A: Processor (U1.160), CPLD (U8.18)
DSP_PWM1B: Processor (U1.161), CPLD (U8.17)
DSP_PWM2A: Processor (U1.162), CPLD (U8.16)
DSP_PWM2B: Processor (U1.163), CPLD (U8.15)
DSP_PWM3A: Processor (U1.164), CPLD (U8.14)
DSP_PWM3B: Processor (U1.165), CPLD (U8.12)
DSP_PWM4A: Processor (U1.166), CPLD (U8.10)
DSP_PWM4B: Processor (U1.167), CPLD (U8.9)
DSP_PWM5A: Processor (U1.18), CPLD (U8.189)
DSP_PWM5B: Processor (U1.19), CPLD (U8.188)
DSP_PWM6A: Processor (U1.1), CPLD (U8.208)
DSP_PWM6B: Processor (U1.2), CPLD (U8.206)
DSP_PWM7A: Processor (U1.4), CPLD (U8.205)
DSP_PWM7B: Processor (U1.5), CPLD (U8.203)
DSP_PWM8A: Processor (U1.6), CPLD (U8.202)
DSP_PWM8B: Processor (U1.7), CPLD (U8.201)
DSP_PWM9A: Processor (U1.8), CPLD (U8.200)
DSP_PWM9B: Processor (U1.9), CPLD (U8.199)
DSP_PWM10A: Processor (U1.10), CPLD (U8.195)
DSP_PWM10B: Processor (U1.12), CPLD (U8.194)
DSP_PWM11A: Processor (U1.13), CPLD (U8.193)
DSP_PWM11B: Processor (U1.14), CPLD (U8.192)
DSP_PWM12A: Processor (U1.22), CPLD (U8.187)
DSP_PWM12B: Processor (U1.23), CPLD (U8.186)
GPIO24: Processor (U1.24), CPLD (U8.185)
GPIO25: Processor (U1.25), CPLD (U8.184)
GPIO26: Processor (U1.27), CPLD (U8.183)
GPIO27: Processor (U1.28), CPLD (U8.182)
GPIO28: Processor (U1.64), CPLD (U8.197)
GPIO29: Processor (U1.65), CPLD (U8.196)
GPIO30: Processor (U1.63), CPLD (U8.198)
GPIO31: Processor (U1.66), CPLD (U8.25)
GPIO32: Processor (U1.67), CPLD (U8.27)
GPIO33: Processor (U1.69), CPLD (U8.30)
GPIO34: Processor (U1.70), CPLD (U8.31)
GPIO35: Processor (U1.71), CPLD (U8.32)
GPIO36: Processor (U1.83), CPLD (U8.40)
GPIO37: Processor (U1.84), CPLD (U8.41)
GPIO40: Processor (U1.87), CPLD (JP9.2 U8.43)
GPIO41: Processor (U1.89), CPLD (JP10.2 U8.71)
GPIO42: Processor (U1.130), CPLD (U8.51)
GPIO43: Processor (U1.131), CPLD (U8.50)
GPIO44: Processor (U1.113), CPLD (U8.58)
GPIO45: Processor (U1.115), CPLD (U8.57)
GPIO46: Processor (U1.128), CPLD (U8.55)
GPIO47: Processor (U1.129), CPLD (U8.54)
GPIO58: Processor (U1.103), CPLD (U8.70)
GPIO59: Processor (U1.104), CPLD (U8.69)
GPIO60: Processor (U1.105), CPLD (U8.67)
GPIO61: Processor (U1.107), CPLD (U8.66)
GPIO62: Processor (U1.108), CPLD (U8.65)
GPIO63: Processor (U1.109), CPLD (U8.64)
GPIO64: Processor (U1.110), CPLD (U8.63)
GPIO65: Processor (U1.111), CPLD (U8.62)
GPIO66: Processor (U1.112), CPLD (U8.61)
GPIO67: Processor (U1.132), CPLD (U8.49)
GPIO68: Processor (U1.133), CPLD (U8.48)
GPIO69: Processor (U1.134), CPLD (U8.47)
GPIO70: Processor (U1.135), CPLD (U8.46)
GPIO71: Processor (U1.136), CPLD (U8.45)
GPIO74: Processor (U1.141), CPLD (U8.39)
GPIO75: Processor (U1.142), CPLD (U8.38)
GPIO76: Processor (U1.143), CPLD (U8.37)
GPIO77: Processor (U1.144), CPLD (U8.36)
GPIO78: Processor (U1.145), CPLD (U8.35)
GPIO79: Processor (U1.146), CPLD (U8.34)
GPIO80: Processor (U1.148), CPLD (U8.23)
GPIO81: Processor (U1.149), CPLD (U8.29)
GPIO82: Processor (U1.150), CPLD (U8.28)
GPIO83: Processor (U1.151), CPLD (U8.22)
GPIO85: Processor (U1.155), CPLD (U8.21)
GPIO86: Processor (U1.156), CPLD (U8.20)
GPIO87: Processor (U1.157), CPLD (U8.19)
GPIO88: Processor (U1.170), CPLD (U8.8)
GPIO89: Processor (U1.171), CPLD (U8.7)
GPIO90: Processor (U1.172), CPLD (U8.6)
GPIO91: Processor (U1.173), CPLD (U8.5)
GPIO92: Processor (U1.174), CPLD (U8.4)
GPIO93: Processor (U1.175), CPLD (U8.3)
GPIO94: Processor (U1.176), CPLD (U8.2)
GPIO99: Processor (U1.17), CPLD (U8.191)
GPIO133: Processor (U1.118), CPLD (U8.56)
MEAS_8_MINUS: Connector_0 (J2.17), AD_1 (R97.1)
MEAS_8_PLUS: Connector_0 (J2.18), AD_1 (R101.1)
MEAS_9_MINUS: Connector_0 (J2.19), AD_1 (R109.1)
MEAS_9_PLUS: Connector_0 (J2.20), AD_1 (R113.1)
MEAS_10_MINUS: Connector_0 (J3.1), AD_1 (R121.1)
MEAS_10_PLUS: Connector_0 (J3.2), AD_1 (R125.1)
MEAS_11_MINUS: Connector_0 (J3.3), AD_1 (R133.1)
MEAS_11_PLUS: Connector_0 (J3.4), AD_1 (R137.1)
MEAS_12_MINUS: Connector_0 (J3.5), AD_1 (R98.1)
MEAS_12_PLUS: Connector_0 (J3.6), AD_1 (R102.1)
MEAS_13_MINUS: Connector_0 (J3.7), AD_1 (R110.1)
MEAS_13_PLUS: Connector_0 (J3.8), AD_1 (R114.1)
MEAS_14_MINUS: Connector_0 (J3.9), AD_1 (R122.1)
MEAS_14_PLUS: Connector_0 (J3.10), AD_1 (R126.1)
MEAS_15_MINUS: Connector_0 (J3.11), AD_1 (R134.1)
MEAS_15_PLUS: Connector_0 (J3.12), AD_1 (R138.1)
MEAS_16_MINUS: Connector_0 (J3.13), AD_2 (R144.1)
MEAS_16_PLUS: Connector_0 (J3.14), AD_2 (R146.1)
MEAS_17_MINUS: Connector_0 (J3.15), AD_2 (R150.1)
MEAS_17_PLUS: Connector_0 (J3.16), AD_2 (R152.1)
MEAS_18_MINUS: Connector_0 (J3.17), AD_2 (R156.1)
MEAS_18_PLUS: Connector_0 (J3.18), AD_2 (R158.1)
MEAS_19_MINUS: Connector_0 (J3.19), AD_2 (R162.1)
MEAS_19_PLUS: Connector_0 (J3.20), AD_2 (R164.1)
PWR_ON_RST: Processor (U1.124), Supply (C62.2 R24.1), CPLD (U8.60)
REF_1V5: Supply (C53.2 R19.1 R20.1 R22.1), AD_0 (8 pins), AD_1 (8 pins), AD_2 (R148.2 R154.2 R160.2 R166.2)
SCIA_RX: Processor (U1.93), Connector_0 (U6.2)
SCIA_TX: Processor (U1.90), Connector_0 (U6.3)
SCIC_RX: Processor (U1.86), Connector_0 (J4.11), Mezz_Board (J8.18 J10.11)
SCIC_TX: Processor (U1.85), Connector_0 (J4.12), Mezz_Board (J8.17 J10.12)
Spare_0: CPLD (JP5.2 U8.97), Connector_0 (J4.13), Mezz_Board (J8.3 J10.13)
Spare_1: CPLD (JP6.2 U8.99), Connector_0 (J4.14), Mezz_Board (J8.5 J10.14)
Spare_2: CPLD (JP7.2 U8.100), Connector_0 (J4.15), Mezz_Board (J8.7 J10.15)
Spare_3: CPLD (JP8.2 U8.101), Connector_0 (J4.16), Mezz_Board (J8.9 J10.16)
Spare_4: CPLD (U8.102), Connector_0 (J4.17), Mezz_Board (J8.11 J10.17)
Spare_5: CPLD (U8.103), Connector_0 (J4.18), Mezz_Board (J8.13 J10.18)
Spare_6: CPLD (U8.106), Connector_0 (J4.19), Mezz_Board (J8.15 J10.19)
SPIA_CLK: Processor (U1.101), Connector_0 (J4.6), Mezz_Board (J10.6 U21.10)
SPIA_SIMO: Processor (U1.98), Connector_0 (J4.4), Mezz_Board (J10.4 U21.8)
SPIA_SOMI: Processor (U1.100), Connector_0 (J4.3), Mezz_Board (J10.3)
SPIC_CLK: Processor (U1.96), Connector_0 (J4.8), Mezz_Board (J10.8 U19.3)
SPIC_SIMO: Processor (U1.94), Connector_0 (J4.10), Mezz_Board (J10.10 U19.6)
SPIC_SOMI: Processor (U1.95), Connector_0 (J4.9), Mezz_Board (J10.9)
VREFHI_ALL: Processor (U1.35 U1.37 U1.53 U1.55), Supply (6 pins)